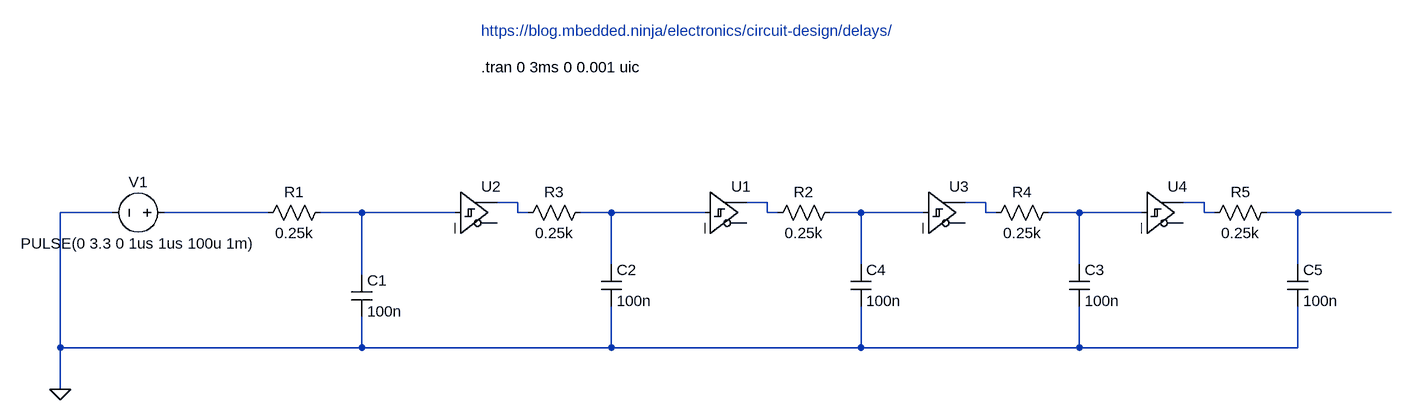
[diagram p0: schematic multi-schmitts.asc]
multi-schmitts.asc, the LTspice schematic file:
Version 4
SHEET 1 4500 760
WIRE 432 96 400 96
WIRE 816 96 784 96
WIRE 1152 96 1120 96
WIRE 1488 96 1456 96
WIRE -192 112 -272 112
WIRE 48 112 -112 112
WIRE 192 112 128 112
WIRE 336 112 192 112
WIRE 432 112 432 96
WIRE 448 112 432 112
WIRE 576 112 528 112
WIRE 720 112 576 112
WIRE 816 112 816 96
WIRE 832 112 816 112
WIRE 960 112 912 112
WIRE 1056 112 960 112
WIRE 1152 112 1152 96
WIRE 1168 112 1152 112
WIRE 1296 112 1248 112
WIRE 1392 112 1296 112
WIRE 1488 112 1488 96
WIRE 1504 112 1488 112
WIRE 1632 112 1584 112
WIRE 1776 112 1632 112
WIRE 576 192 576 112
WIRE 960 192 960 112
WIRE 1296 192 1296 112
WIRE 1632 192 1632 112
WIRE 192 208 192 112
WIRE -272 320 -272 112
WIRE 192 320 192 272
WIRE 192 320 -272 320
WIRE 576 320 576 256
WIRE 576 320 192 320
WIRE 960 320 960 256
WIRE 960 320 576 320
WIRE 1296 320 1296 256
WIRE 1296 320 960 320
WIRE 1632 320 1632 256
WIRE 1632 320 1296 320
WIRE -272 384 -272 320
FLAG -272 384 0
SYMBOL res 144 96 R90
WINDOW 0 0 56 VBottom 2
WINDOW 3 32 56 VTop 2
SYMATTR InstName R1
SYMATTR Value 0.25k
SYMATTR SpiceLine tol=1 pwr=0.1
SYMBOL cap 176 208 R0
SYMATTR InstName C1
SYMATTR Value 100n
SYMBOL voltage -96 112 M270
WINDOW 0 32 56 VTop 2
WINDOW 3 -32 56 VBottom 2
WINDOW 123 0 0 Left 0
WINDOW 39 0 0 Left 0
SYMATTR InstName V1
SYMATTR Value PULSE(0 3.3 0 1us 1us 100u 1m)
SYMBOL Digital\\schmitt 336 48 R0
SYMATTR InstName U2
SYMBOL res 544 96 R90
WINDOW 0 0 56 VBottom 2
WINDOW 3 32 56 VTop 2
SYMATTR InstName R3
SYMATTR Value 0.25k
SYMATTR SpiceLine tol=1 pwr=0.1
SYMBOL cap 560 192 R0
SYMATTR InstName C2
SYMATTR Value 100n
SYMBOL Digital\\schmitt 720 48 R0
SYMATTR InstName U1
SYMBOL res 928 96 R90
WINDOW 0 0 56 VBottom 2
WINDOW 3 32 56 VTop 2
SYMATTR InstName R2
SYMATTR Value 0.25k
SYMATTR SpiceLine tol=1 pwr=0.1
SYMBOL cap 944 192 R0
SYMATTR InstName C4
SYMATTR Value 100n
SYMBOL Digital\\schmitt 1056 48 R0
SYMATTR InstName U3
SYMBOL res 1264 96 R90
WINDOW 0 0 56 VBottom 2
WINDOW 3 32 56 VTop 2
SYMATTR InstName R4
SYMATTR Value 0.25k
SYMATTR SpiceLine tol=1 pwr=0.1
SYMBOL cap 1280 192 R0
SYMATTR InstName C3
SYMATTR Value 100n
SYMBOL Digital\\schmitt 1392 48 R0
SYMATTR InstName U4
SYMBOL res 1600 96 R90
WINDOW 0 0 56 VBottom 2
WINDOW 3 32 56 VTop 2
SYMATTR InstName R5
SYMATTR Value 0.25k
SYMATTR SpiceLine tol=1 pwr=0.1
SYMBOL cap 1616 192 R0
SYMATTR InstName C5
SYMATTR Value 100n
TEXT 376 -112 Left 2 !.tran 0 3ms 0 0.001 uic
TEXT 376 -168 Left 2 ;https://blog.mbedded.ninja/electronics/circuit-design/delays/

The netlist it stands for:
* multi-schmitts.asc
R1 N006 N005 0.25k tol=1 pwr=0.1
C1 N006 0 100n
V1 N005 0 PULSE(0 3.3 0 1us 1us 100u 1m)
A§U2 N006 0 0 0 0 0 N001 0 SCHMITT
R3 N007 N001 0.25k tol=1 pwr=0.1
C2 N007 0 100n
A§U1 N007 0 0 0 0 0 N002 0 SCHMITT
R2 N008 N002 0.25k tol=1 pwr=0.1
C4 N008 0 100n
A§U3 N008 0 0 0 0 0 N003 0 SCHMITT
R4 N009 N003 0.25k tol=1 pwr=0.1
C3 N009 0 100n
A§U4 N009 0 0 0 0 0 N004 0 SCHMITT
R5 N010 N004 0.25k tol=1 pwr=0.1
C5 N010 0 100n
.tran 0 3ms 0 0.001 uic
* https://blog.mbedded.ninja/electronics/circuit-design/delays/
.backanno
.end